# Altium schematic sheet lab1_yarmak_usb_spi.SchDoc: =title_line_1 + title_line_2
size 594 x 420 mm; SheetNumber: n
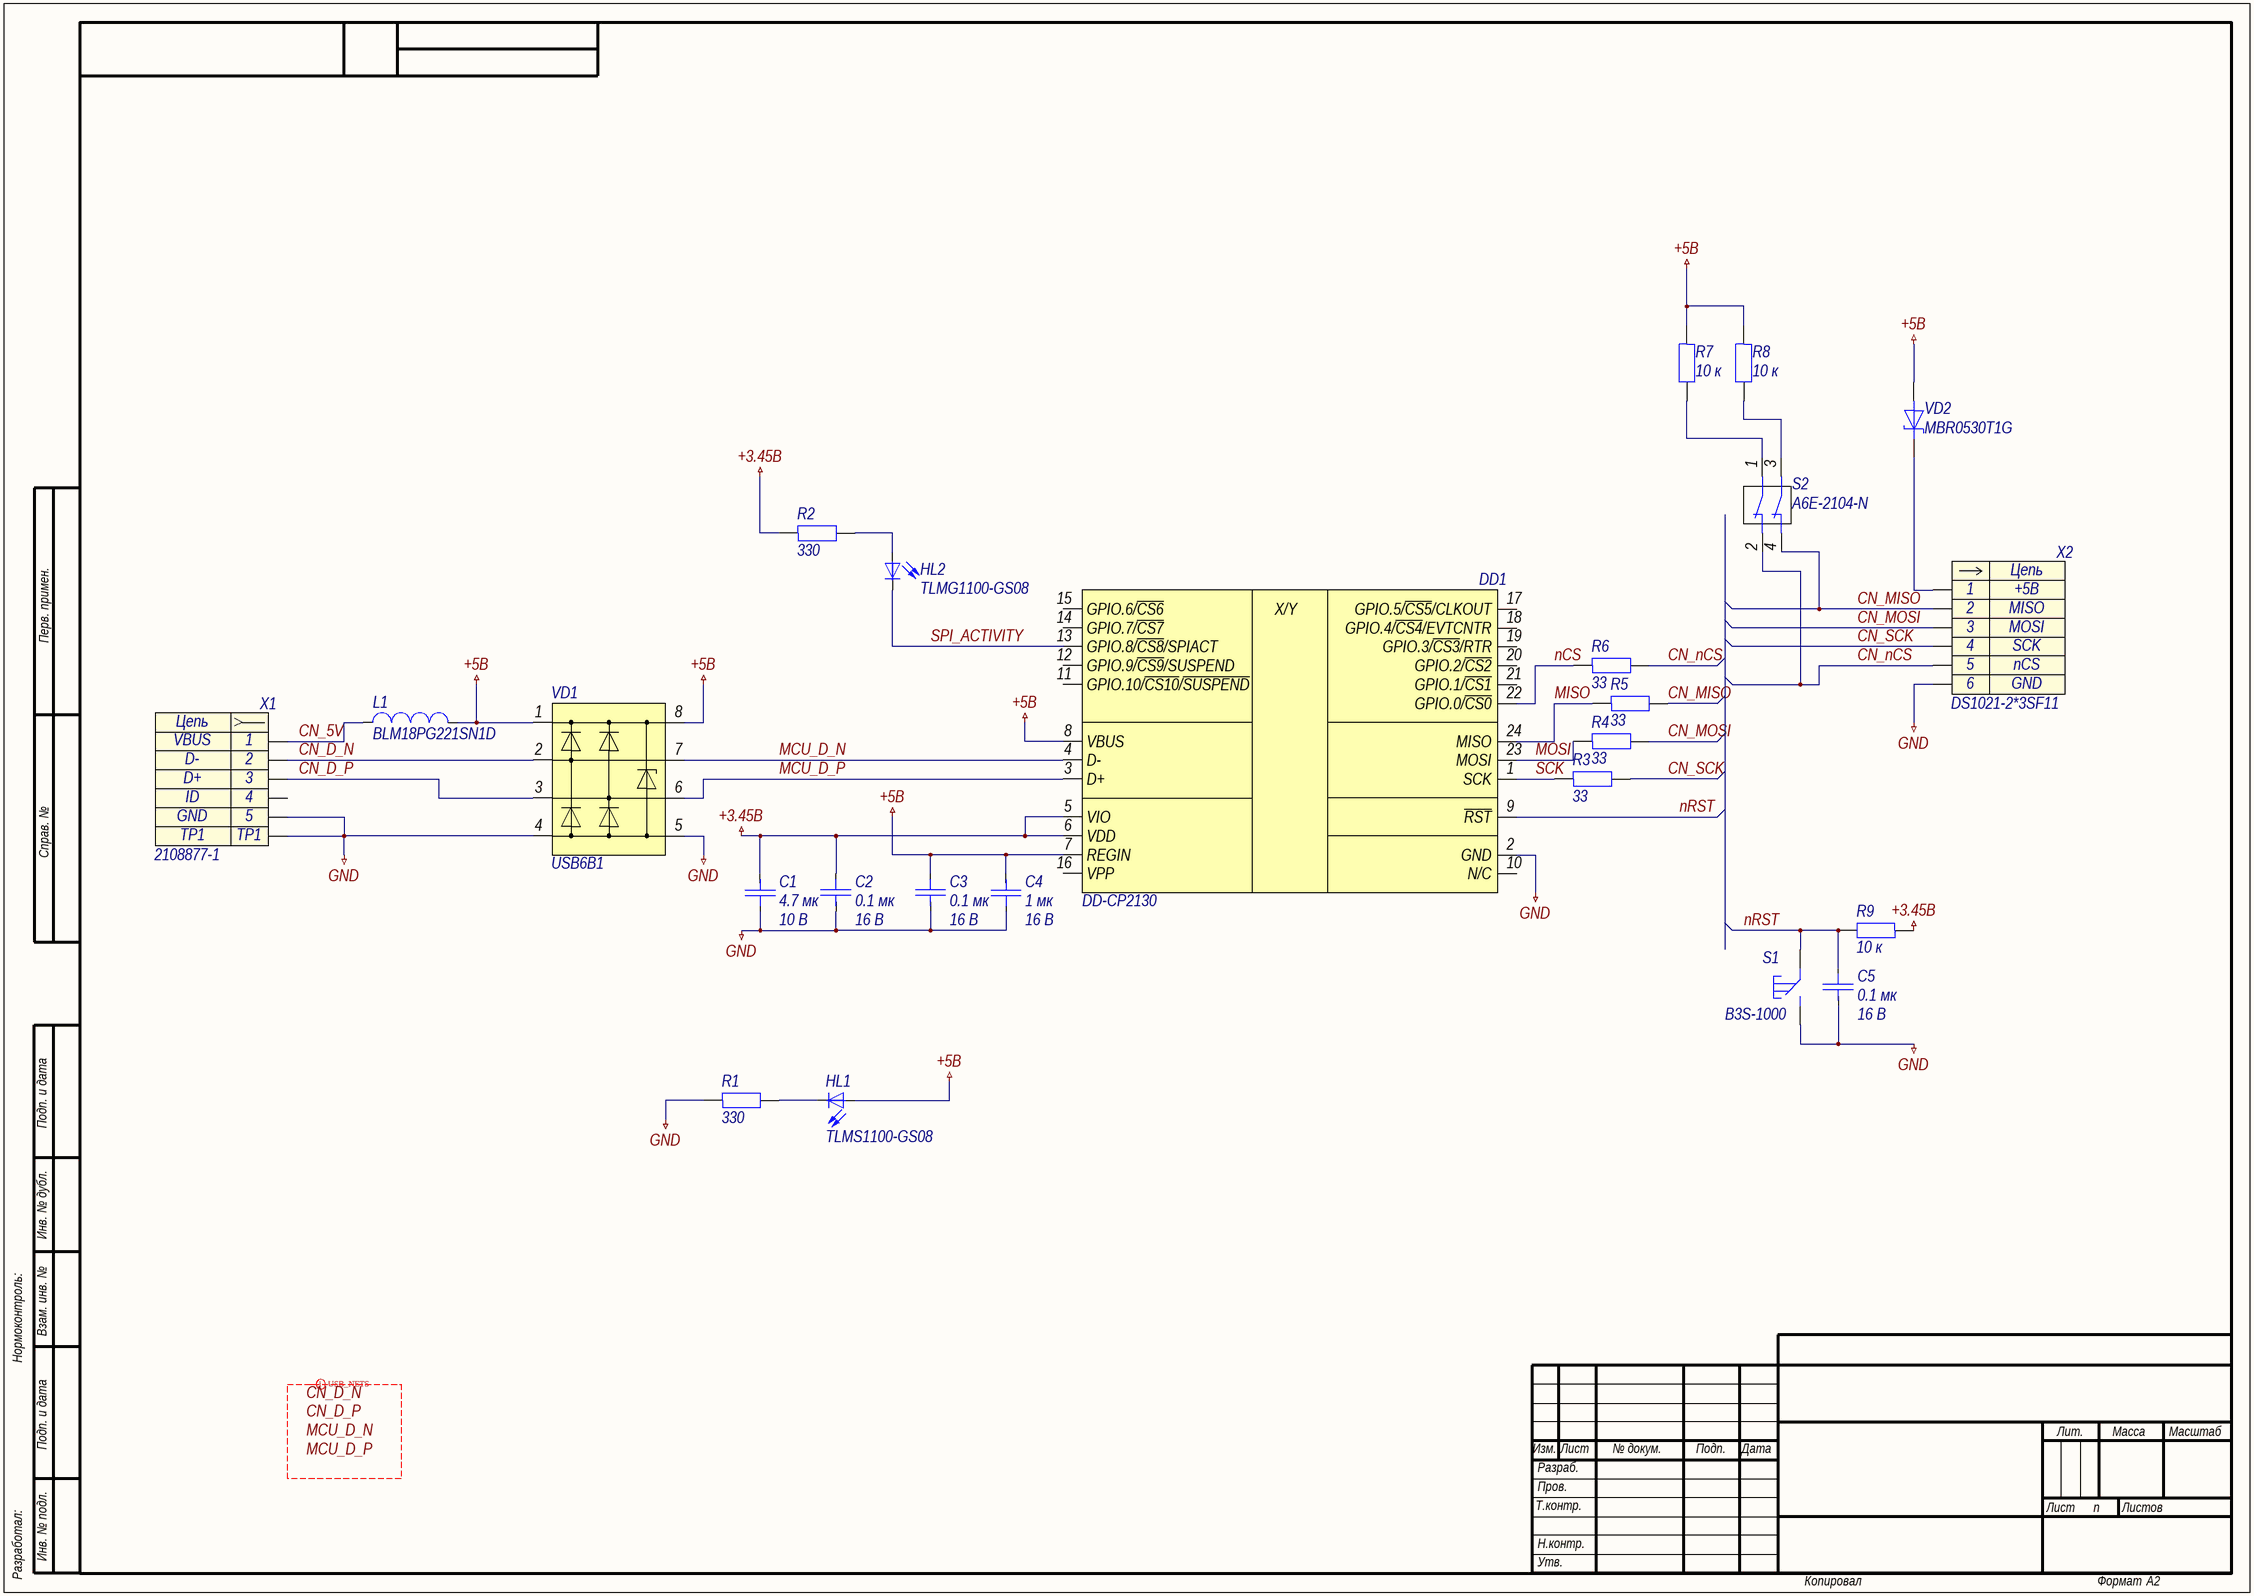
[diagram p0: lab1_yarmak_usb_spi.SchDoc]

## Parts
C1  4.7 мк  Напряжение: 10 В  [C0402]
C2  0.1 мк  Напряжение: 16 В  [C0402]
C3  0.1 мк  Напряжение: 16 В  [C0402]
C4  1 мк  Напряжение: 16 В  [C0402]
C5  0.1 мк  Напряжение: 16 В  [C0402]
DD1  DD-CP2130  [CP2130]
HL1  TLMS1100-GS08  [LED]
HL2  TLMG1100-GS08  [LED_GREEN]
L1  BLM18PG221SN1D  [L0603]
R1  330  [R0603]
R2  330  [R0603]
R3  33  [R0603]
R4  33  [R0603]
R5  33  [R0603]
R6  33  [R0603]
R7  10 к  [R0603]
R8  10 к  [R0603]
R9  10 к  [R0603]
S1  B3S-1000  [BUTTON]
S2  A6E-2104-N  [A6E-2104-N]
VD1  USB6B1  [SOIC-8-P127-490X390X175-L84X41]
VD2  MBR0530T1G  [SOD-123-368X160X135]
X1  2108877-1  [2108877-1]
X2  DS1021-2*3SF11  [PLS_2.54_2x3]

## Nets
+3.45В: C1.2 C2.1 DD1.5(VIO) DD1.6(VDD) R2.1 R9.1
+5В: C3.1 C4.2 DD1.7(REGIN) DD1.8(VBUS) HL1.1(A) L1.2 R7.1 R8.1 VD1.1 VD1.8 VD2.2
GND: C1.1 C2.2 C3.2 C4.1 C5.2 DD1.2(GND) R1.1 VD1.4 VD1.5 X1.5 X1.TP1 X2.6
CN_5V: L1.1 X1.1
CN_D_N: VD1.2 X1.2
CN_D_P: VD1.3 X1.3
CN_MISO: R5.2 S2.4 X2.2
CN_MOSI: R4.2 X2.3
CN_nCS: R6.2 S2.2 X2.5
CN_SCK: R3.2 X2.4
MCU_D_N: DD1.4(D-) VD1.7
MCU_D_P: DD1.3(D+) VD1.6
MISO: DD1.24(MISO) R5.1
MOSI: DD1.23(MOSI) R4.1
nCS: DD1.22(GPIO.0/~{CS0}) R6.1
nRST: C5.1 DD1.9(~{RST}) R9.2 S1.2
SCK: DD1.1(SCK) R3.1
SPI_ACTIVITY: DD1.13(GPIO.8/~{CS8}/SPIACT) HL2.2(K)
NetHL1_2: HL1.2(K) R1.2
NetHL2_1: HL2.1(A) R2.2
NetR7_2: R7.2 S2.1
NetR8_2: R8.2 S2.3
NetVD2_1: VD2.1 X2.1

Not connected (* = marked no-connect by the designer): DD1 10(N/C) 11(GPIO.10/~{CS10}/~{SUSPEND}) 12(GPIO.9/~{CS9}/SUSPEND) 14(GPIO.7/~{CS7}) 15(GPIO.6/~{CS6}) 16(VPP) 17(GPIO.5/~{CS5}/CLKOUT) 18(GPIO.4/~{CS4}/EVTCNTR) 19(GPIO.3/~{CS3}/RTR) 20(GPIO.2/~{CS2}) 21(GPIO.1/~{CS1}); S1 1; X1 4

## Layout directives
differential pair; differential pair class USB_SIGNALS: CN_D_N, CN_D_P, MCU_D_N, MCU_D_P

## Notes on the sheet
- Labels drawn without touching a wire or pin: CN_D_N, CN_D_P, MCU_D_N, MCU_D_P
- Перв. примен.
- Справ. №
- Подп. и дата
- Инв. № дубл.
- Нормоконтроль:
- Взам. инв. №
- Изм.
- Лист
- № докум.
- Подп.
- Дата
- Лит.
- Масса
- Масштаб
- Т.контр.
- Пров.
- Разраб.
- Листов
- Разработал:
- Инв. № подл.
- Н.контр.
- Утв.
- Копировал
- Формат
- А2
- (in symbol dd0001) X/Y
- (in symbol x0001) Цепь
- (in symbol x0002) Цепь; VBUS; D-; D+; ID; GND

## Library data of the parts
C1 = c0002: =Описание; ID: c0002; Фамилия: Засецкий; Описание: Конденсатор чип 0402 4,7 мкФ 10 В ±10 %; Наименование: CL05A475KP5NRNC; Производитель: Samsung electro-mechanics; Отклонение: ±10 %; Рабочие температуры: от -55 °С до +85 °С; Корпус: 0402; Примечание: X5R; Номинал: 4.7 мк; Номинальное напряжение: 10 В; HelpURL: http://product.samsungsem.com/mlcc/CL05A475KP5NRN.do
C2 C3 C5 = c0003: =Описание; ID: c0003; Фамилия: Засецкий; Описание: Конденсатор чип 0402 0,1 мкФ 16 В ±5 %; Наименование: CL05B104JO5NNNC; Производитель: Samsung electro-mechanics; Отклонение: ±5 %; Рабочие температуры: от -55 °С до +125 °С; Корпус: 0402; Примечание: X7R; Номинал: 0.1 мк; Номинальное напряжение: 16 В; HelpURL: http://product.samsungsem.com/mlcc/CL05B104JO5NNN.do
C4 = c0004: =Описание; ID: c0004; Фамилия: Засецкий; Описание: Конденсатор чип 0402 1 мкФ 16 В ±10 %; Наименование: CL05A475KP5NRNC; Производитель: Samsung electro-mechanics; Отклонение: ±10 %; Рабочие температуры: от -55 °С до +85 °С; Корпус: 0402; Примечание: X5R; Номинал: 1 мк; Номинальное напряжение: 16 В; HelpURL: http://product.samsungsem.com/mlcc/CL05A105KO5NNN.do
DD1 = dd0001: =Описание; ID: dd0001; Фамилия: Засецкий; Описание: Контроллер интерфейса ввода вывода USB to SPI Bridge QFN24; Производитель: Silicon Labs; Рабочие температуры: от -40 °С до +85 °С; Корпус: QFN-24; Наименование: CP2130; HelpURL: https://www.silabs.com/documents/public/data-sheets/CP2130.pdf
HL1 = hl0001: =Описание; ID: hl0001; Фамилия: Засецкий; Описание: Светодиод красный чип 0603; Производитель: Vishay; Рабочие температуры: от -40 °С до +100 °С; Номинальный ток: 30 мА; Корпус: 0603; Примечание: Красный; Наименование: TLMS1100-GS08; HelpURL: https://www.vishay.com/docs/83173/tlmb1100.pdf
HL2 = hl0002: =Описание; ID: hl0002; Фамилия: Засецкий; Описание: Светодиод зелёный чип 0603; Производитель: Vishay; Рабочие температуры: от -40 °С до +100 °С; Номинальный ток: 30 мА; Корпус: 0603; Примечание: Зелёный; Наименование: TLMG1100-GS08; HelpURL: https://www.vishay.com/docs/83173/tlmb1100.pdf
L1 = l0001: =Описание; ID: l0001; Фамилия: Засецкий; Описание: Ферритовая бусина; Производитель: muRata; Отклонение: ±25 %; Рабочие температуры: от -55 °С до +125 °С; Номинальный ток: 1 А; Корпус: 0603; Наименование: BLM18PG221SN1D; HelpURL: http://www.yageo.ru/pdf/RC0603.pdf
R1 R2 = r0004: =Описание; ID: r0004; Фамилия: Засецкий; Описание: Резистор чип 0603 330 Ом 0,1 Вт ±1 %; Наименование: RC0603FR-07330RL; Производитель: Yageo; Отклонение: ±1 %; Номинальное напряжение: 50 В; Рабочие температуры: от -50 °С до +150 °С; Номинальный ток: 1 А; Корпус: 0603; Номинал: 330; HelpURL: http://www.yageo.ru/pdf/RC0603.pdf
R3-R6 = r0007: =Описание; ID: r0007; Фамилия: Засецкий; Описание: Резистор чип 0603 33 Ом 0,1 Вт ±1 %; Наименование: RC0603FR-0733RL; Производитель: Yageo; Отклонение: ±1 %; Номинальное напряжение: 50 В; Рабочие температуры: от -50 °С до +150 °С; Номинальный ток: 1 А; Корпус: 0603; Номинал: 33; HelpURL: http://www.yageo.ru/pdf/RC0603.pdf
R7-R9 = r0006: =Описание; ID: r0006; Фамилия: Засецкий; Описание: Резистор чип 0603 10 кОм 0,1 Вт ±1 %; Наименование: RC0603FR-0710KL; Производитель: Yageo; Отклонение: ±1 %; Номинальное напряжение: 50 В; Рабочие температуры: от -50 °С до +150 °С; Номинальный ток: 1 А; Корпус: 0603; Номинал: 10 к; HelpURL: http://www.yageo.ru/pdf/RC0603.pdf
S1 = sw0001: =Описание; ID: sw0001; Фамилия: Засецкий; Описание: Кнопка; Производитель: Omron; Наименование: B3S-1000; HelpURL: https://omronfs.omron.com/en_US/ecb/products/pdf/en-b3s.pdf
S2 = sw0002: =Описание; ID: sw0002; Фамилия: Засецкий; Описание: Переключатель; Производитель: Omron; Наименование: A6E-2104-N; HelpURL: https://omronfs.omron.com/en_US/ecb/products/pdf/en-a6en.pdf
VD1 = vd0011: =Описание; ID: vd0011; Фамилия: Ларионов; Описание: Диодная сборка для подавления помех, от 6 В; Производитель: STMicroelectronics; Корпус: SOIC-8; Наименование: USB6B1; HelpURL: https://www.st.com/content/st_com/en/products/protection-devices/esd-protection/usb-port-protection/usb6b1.html
VD2 = vd0001: =Описание; ID: vd0001; Фамилия: Шкабара; Описание: Диод Шоттки 30 В 0,5 А; Производитель: ON Semiconductor; Максимальное прямое напряжение: 0,43 В; Максимальное обратное напряжение: 30 В; Максимальный прямой ток: 0,5 А; Рабочие температуры: от –65 °С до +125 °С; Корпус: SOD-123; Наименование: MBR0530T1G; HelpURL: https://www.onsemi.com/products/discretes-drivers/diodes-rectifiers/schottky-diodes-schottky-rectifiers/mbr0530t1g
X1 = x0002: =Описание; ID: x0002; Фамилия: Засецкий; Описание: Разъём micro USB-B; Наименование: 2108877-1
X2 = x0001: =Описание; Contact_05: nCS; Фамилия: Засецкий; Описание: Разъём штыревой 2x3 контактов; Contact_01: +5В; Contact_02: MISO; Contact_03: MOSI; Contact_04: SCK; Contact_06: GND; Наименование: DS1021-2*3SF11